# EAGLE design SparkFun_LilyPad_Tricolor-LED (EAGLE 7.2.0)
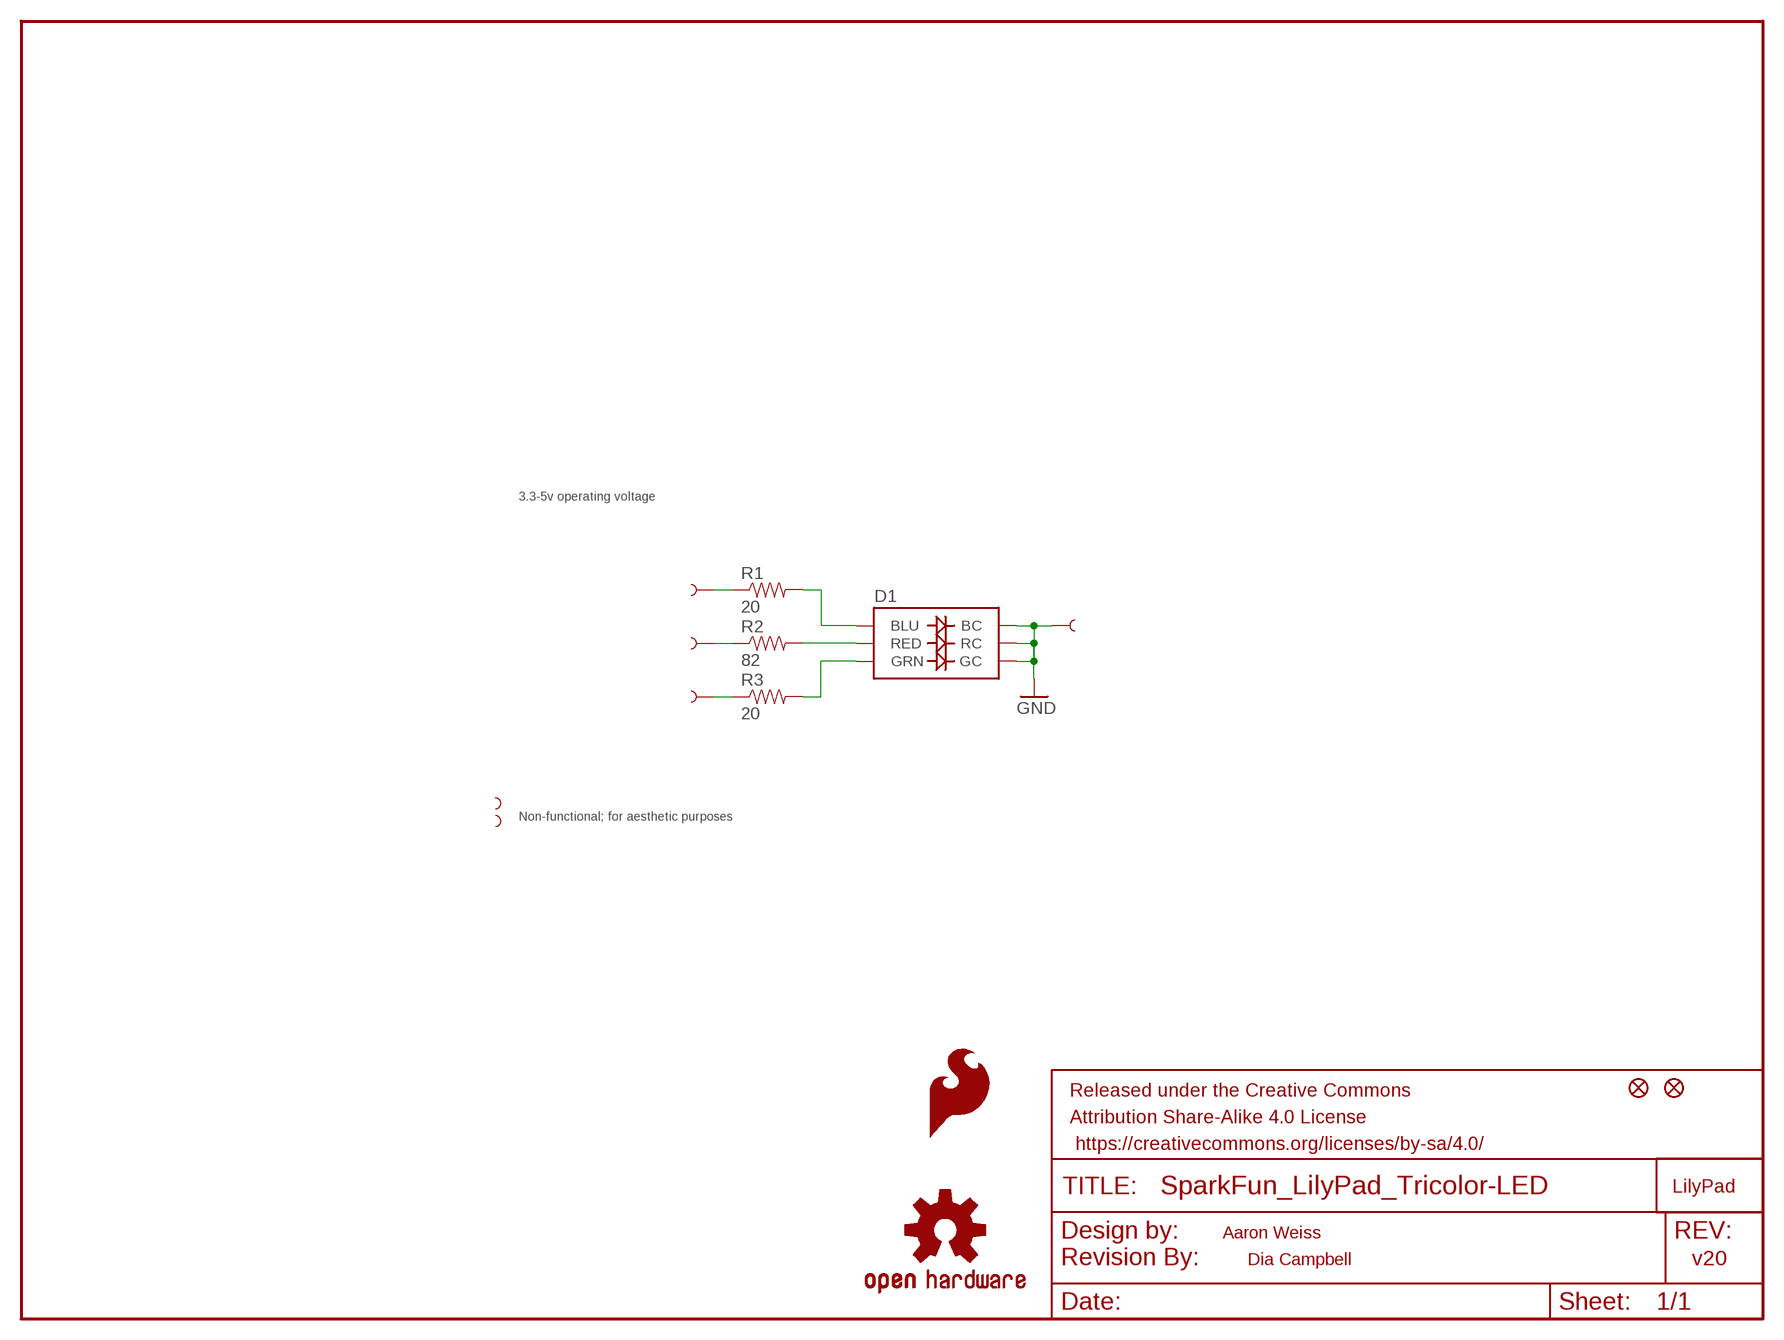
[diagram p0: schematic, sheet 1]

## Parts
BLU  SEWTAP6  [PETAL-SMALL-2SIDE]
D1  LED-TRICOLOR-NO-COMPLCC-6-SMD  [PLCC-6-LED]
FID1  FIDUCIAL1X2  [FIDUCIAL-1X2]
FID2  FIDUCIAL1X2  [FIDUCIAL-1X2]
FRAME1  FRAME-LETTER  [CREATIVE_COMMONS]
GND  SEWTAP6  [PETAL-SMALL-2SIDE]
GRN  SEWTAP6  [PETAL-SMALL-2SIDE]
LOGO1  OSHW-LOGOS  [OSHW-LOGO-S]
LOGO2  SFE_LOGO_FLAME.1_INCH  [SFE_LOGO_FLAME_.1]
R1  20  20OHM1/10W1%(0603)SMD  [0603-RES]
R2  82  82OHM-1/10W-1%(0603)SMD  [0603-RES]
R3  20  20OHM1/10W1%(0603)SMD  [0603-RES]
RED  SEWTAP6  [PETAL-SMALL-2SIDE]
U$1  LOGO-LPLP  [LOGO-LILYPAD]
U$2  SEWTAP-NOHOLE2  [PETAL-NOHOLE-2SIDE]
U$3  SEWTAP-NOHOLE2  [PETAL-NOHOLE-2SIDE]
U$4  REVISION  [REVISION]

## Nets
BLU: D1.AB(BLU) R1.2
GND: D1.CB(BC) D1.CG(GC) D1.CR(RC) GND.1
GRN: D1.AG(GRN) R3.2
N$1: BLU.1 R1.1
N$2: R2.1 RED.1
N$3: GRN.1 R3.1
RED: D1.AR(RED) R2.2

## Notes on the sheet
- 3.3-5v operating voltage
- Non-functional; for aesthetic purposes
- Aaron Weiss
- Dia Campbell | v20

## Library data of the parts
BLU GND GRN RED = LilyPad-Wearables:SEWTAP: Sew Taps for LilyPad Boards.
D1 = SparkFun-LED:LED-TRICOLOR-NO-COM; PROD_ID: DIO-12113
FID1 FID2 = SparkFun-Aesthetics:FIDUCIAL: Fiducial Alignment Points Various fiducial points for machine vision alignment.
FRAME1 = SparkFun-Aesthetics:FRAME-LETTER: Schematic Frame Standard 8.5x11 US Letter frame; DESIGNER: NAME; VERSION: v01
LOGO1 = SparkFun-Aesthetics:OSHW-LOGO: Open Source Hardware Logo This logo indicates the piece of hardware it is found on incorporates a OSHW license and/or adheres to the definition of open source hardware found here: http://freedomdefined.org/OSHW
LOGO2 = SparkFun-Aesthetics:SFE_LOGO_FLAME: SFE Logo, flame only This is the SparkFun flame logo. The logo on the schematic will always be the same size; the package variant is the height of the flame. Default layer for the logo on the board is tSilk.
R1 R3 = SparkFun-Resistors:20OHM1/10W1%(0603): RES-07862; PROD_ID: RES-07862
R2 = SparkFun-Resistors:82OHM-1/10W-1%(0603): RES-12311; PROD_ID: RES-12311
U$1 = LilyPad-Wearables:LOGO-LP
U$2 U$3 = LilyPad-Wearables:SEWTAP-NOHOLE
U$4 = SparkFun-Aesthetics:REVISION

## Board
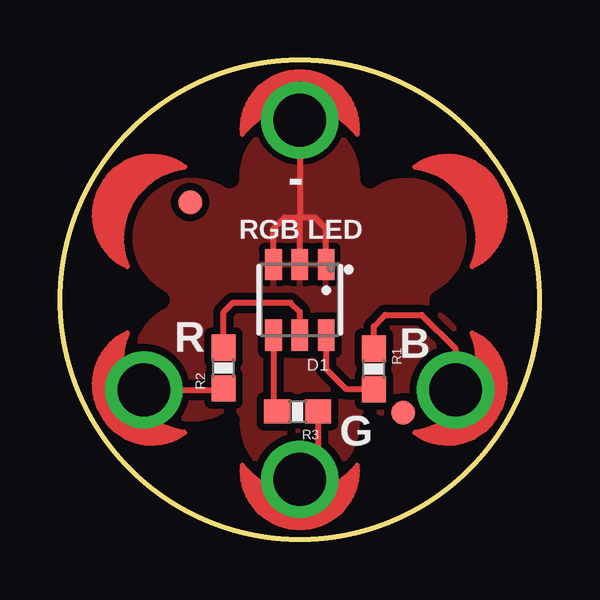
[diagram p1: board, top side]
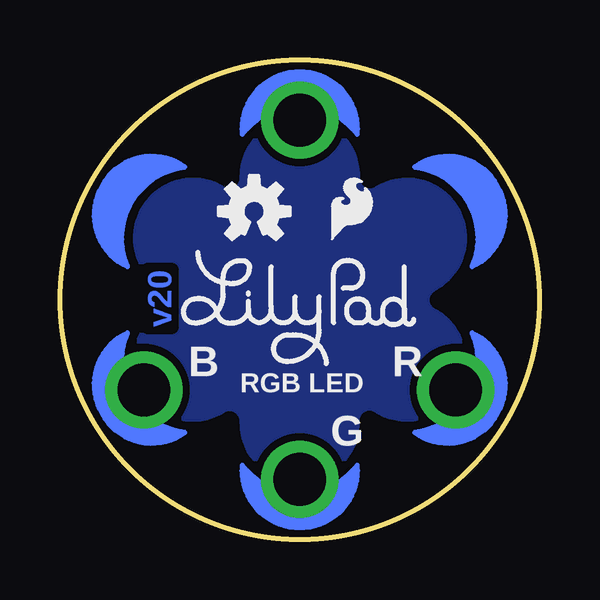
[diagram p2: board, bottom side, seen from below]

Size 20 x 20 mm. Coordinates in mm from the lower left corner, seen from the top.
Outline: circle at 10,10 radius 10
Copper layers (1*16): Top 0.035mm / dielectric 1.5mm / Bottom 0.035mm
Design rules "SparkFun-2-layer-STANDARD": minimum track width 10mil, minimum drill 20mil, track to track 10mil, track to pad 8mil, pad to pad 8mil, via to via 10mil, smd to smd 8mil, copper to edge 8mil, drill to drill 8mil, minimum pad ring 10mil, minimum via ring 10mil, stop-mask expansion 4mil, vias tented up to drill 20mil, thermal gap 10mil
tRestrict: area -1,10 to 10,21; area 10,10 to 21,21; area 10,-1 to 21,10; area -1,-1 to 10,10; area -1,10 to 10,21; area 10,10 to 21,21; area 10,-1 to 21,10; area -1,-1 to 10,10; area -1,10 to 10,21; area 10,10 to 21,21; area 10,-1 to 21,10; area -1,-1 to 10,10; 18 lines
bRestrict: area -1,10 to 10,21; area 10,10 to 21,21; area 10,-1 to 21,10; area -1,-1 to 10,10; area -1,10 to 10,21; area 10,10 to 21,21; area 10,-1 to 21,10; area -1,-1 to 10,10; area -1,10 to 10,21; area 10,10 to 21,21; area 10,-1 to 21,10; area -1,-1 to 10,10; 18 lines

### Footprints (pad centres in the part's own frame; a part is rotated, then mirrored left to right if it is on the bottom)
PETAL-SMALL-2SIDE = drill 2.2: 1 0,0
PLCC-6-LED = smd 0.7 x 1.3: AB -1.1,1.475; AG 1.1,1.475; AR 0,1.475; CB -1.1,-1.475; CG 1.1,-1.475; CR 0,-1.475
FIDUCIAL-1X2 = smd 1 x 1: 1 0,0
0603-RES = smd 1.1 x 1: 1 -0.85,0; 2 0.85,0

### Placement (x,y rotation side)
BLU  16.5,6.24 60 top
D1  10,10 180 top
FID1  5.43,14.06 0 top
FID2  14.32,5.3 0 top
FRAME1  -88.88,10 0 top  (outside the outline)
GND  10,17.49 180 top
GRN  10,2.51 0 top
LOGO1  11.9,13.68 0 bottom
LOGO2  8.98,12.16 0 bottom
R1  13.08,7.12 270 top
R2  6.83,7.15 90 top
R3  9.91,5.34 180 top
RED  3.5,6.24 300 top
U$1  10,10 0 bottom
U$2  16.5,13.76 120 top
U$3  3.5,13.76 240 top
U$4  -77.25,6.95 0 top  (outside the outline)

### Tracks (layer width: path | path; a pad name or v marks a point on that pad's centre or on a via)
BLU
  Top 0.254: D1.AB 11.1,7.12 11.96,6.27 R1.2
GND
  Top 0.254: D1.CR 10,13.3 | 10,13.3 10,13.43 | D1.CG 8.9,12.96 9.37,13.43 9.87,13.43 10,13.3 | D1.CB 11.1,12.96 10.63,13.43 10,13.43 | GND.1 10,13.43
  pour Top (isolate 0.305): -0.92,20.92 -0.92,-0.92 20.8,-0.79 20.8,20.92
GRN
  Top 0.254: D1.AG 8.9,5.5 R3.2
N$1
  Top 0.254: BLU.1 16.5,7.94 15.08,9.37 13.56,9.37 13.08,8.89 R1.1
N$2
  Top 0.254: RED.1 6.77,6.24 R2.1
N$3
  Top 0.254: R3.1 10.76,3.27 GRN.1
N$5
  pour Bottom (isolate 0.305): -0.16,10 arc-90 10,20.16 arc-97 20.16,8.73 arc-84 10,-0.16 arc-88
RED
  Top 0.254: D1.AR 10,9.49 9.62,9.87 7.21,9.87 6.83,9.49 R2.2

### Text on the board
Bottom: v20
tPlace: - | RGB LED | R | B | G
bPlace: R | RGB LED | B | G
Measures: Dimension in inches
tDocu: Thickness 0.8mm | Aaron Weiss | Dia Campbell